# Altium schematic sheet decoupling.SchDoc
size A
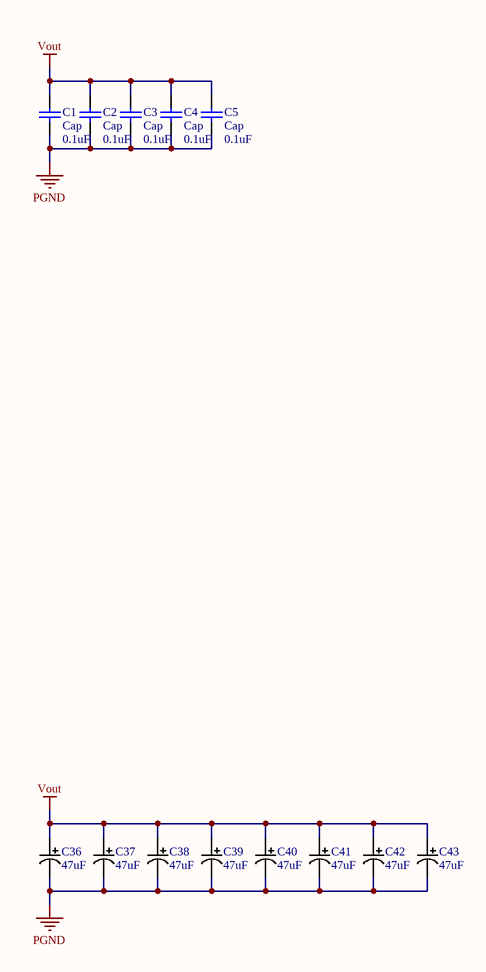
[diagram p0: decoupling.SchDoc]

## Parts
C1  Cap  value 0.1uF  [C0603]
C2  Cap  value 0.1uF  [C0603]
C3  Cap  value 0.1uF  [C0603]
C4  Cap  value 0.1uF  [C0603]
C5  Cap  value 0.1uF  [C0603]
C36  47uF  [CAP_PC_10X10]
C37  47uF  [CAP_PC_10X10]
C38  47uF  [CAP_PC_10X10]
C39  47uF  [CAP_PC_10X10]
C40  47uF  [CAP_PC_10X10]
C41  47uF  [CAP_PC_10X10]
C42  47uF  [CAP_PC_10X10]
C43  47uF  [CAP_PC_10X10]

## Nets
PGND: C1.1 C2.1 C3.1 C4.1 C5.1 C36.2 C37.2 C38.2 C39.2 C40.2 C41.2 C42.2 C43.2
Vout: C1.2 C2.2 C3.2 C4.2 C5.2 C36.1 C37.1 C38.1 C39.1 C40.1 C41.1 C42.1 C43.1

## Library data of the parts
C1-C5 = Cap: Capacitor; Published: 8-Jun-2000; LatestRevisionDate: 17-Jul-2002; LatestRevisionNote: Re-released for DXP Platform.; PackageReference: RAD-0.3; Publisher: Altium Limited; PackageDescription: Radial Cap, Thru-Hole; 2 Leads; 0.3 in Pin Spacing
C36-C43 = A767MU476M1KLAE040: CAP ALUM POLY 47UF 20% 80V SMD; Manufacturer_Part_Number: KEMET; Vendor: Nichicon; Built_By: EMA_Cory; Type: DEV; ESR (Equivalent Series Resistance): 40mR; Life (Hours): 2000Hour; Copyright: Copyright (C) 2018 Accelerated Designs. All rights reserved; RefDes: RefDes; Value: Value; Supplier 1: Digi-Key; Manufacturer: KEMET; Manufacturer Part Number: A767MU476M1KLAE040; RoHS: No; Stock 1: 1540; Pricing 1: 1=3.12000, 10=2.52600, 100=1.92890 (USD); Mount: Surface Mount; Case/Package: Radial; Min Operating Temperature: -55°C; Max Operating Temperature: 105°C; Packaging: Tape and Reel; Capacitance: 47uF; Tolerance: 20%; Voltage Rating: 80V; ComponentLink1URL: https://api.kemet.com/component-edge/download/datasheet/A767MU476M1KLAE040.pdf?src-supplier=Digi-Key; ComponentLink1Description: https://api.kemet.com/component-edge/download/datasheet/A767MU476M1KLAE040.pdf?src-supplier=Digi-Key; Supplier Part Number 1: 399-15651-1-ND; Category: Capacitors; ComponentLink2Description: SupplierDigikey; ComponentLink2URL: https://www.digikey.com/product-detail/en/kemet/A767MU476M1KLAE040/399-15651-6-ND/7392929